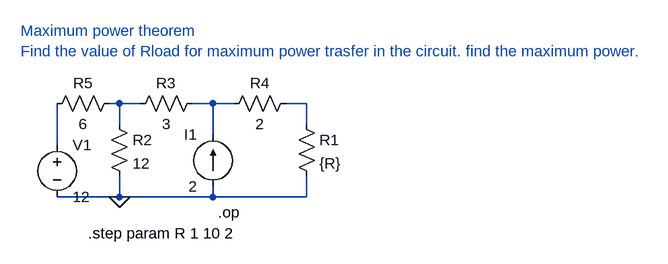
[diagram p0: schematic Lab3_ques1.asc]
Lab3_ques1.asc, the LTspice schematic file:
Version 4
SHEET 1 896 680
WIRE 80 176 64 176
WIRE 112 176 80 176
WIRE 224 176 192 176
WIRE 256 176 224 176
WIRE 368 176 336 176
WIRE 80 208 80 176
WIRE 368 208 368 176
WIRE 224 224 224 176
WIRE -16 240 -16 176
WIRE 80 320 80 288
WIRE 80 320 -16 320
WIRE 224 320 224 304
WIRE 224 320 80 320
WIRE 368 320 368 288
WIRE 368 320 224 320
FLAG 80 320 0
SYMBOL Res 352 192 R0
SYMATTR InstName R1
SYMATTR Value {R}
SYMBOL Res 64 192 R0
SYMATTR InstName R2
SYMATTR Value 12
SYMBOL Res 208 160 R90
WINDOW 0 0 56 VBottom 2
WINDOW 3 32 56 VTop 2
SYMATTR InstName R3
SYMATTR Value 3
SYMBOL Res 352 160 R90
WINDOW 0 0 56 VBottom 2
WINDOW 3 32 56 VTop 2
SYMATTR InstName R4
SYMATTR Value 2
SYMBOL Res 80 160 R90
WINDOW 0 0 56 VBottom 2
WINDOW 3 32 56 VTop 2
SYMATTR InstName R5
SYMATTR Value 6
SYMBOL Voltage -16 224 R0
SYMATTR InstName V1
SYMATTR Value 12
SYMBOL current 224 304 R180
WINDOW 0 24 80 Left 2
WINDOW 3 24 0 Left 2
SYMATTR InstName I1
SYMATTR Value 2
TEXT -72 64 Left 2 ;Maximum power theorem\nFind the value of Rload for maximum power trasfer in the circuit. find the maximum power.
TEXT 32 376 Left 2 !.step param R 1 10 2
TEXT 232 344 Left 2 !.op

The netlist it stands for:
* Lab3_ques1.asc
R1 N003 0 {R}
R2 N001 0 12
R3 N002 N001 3
R4 N003 N002 2
R5 N001 N004 6
V1 N004 0 12
I1 0 N002 2
* Maximum power theorem
* Find the value of Rload for maximum power trasfer in the circuit. find the maximum power.
.step param R 1 10 2
.op
.backanno
.end